# Altium schematic sheet programming.SchDoc
size A
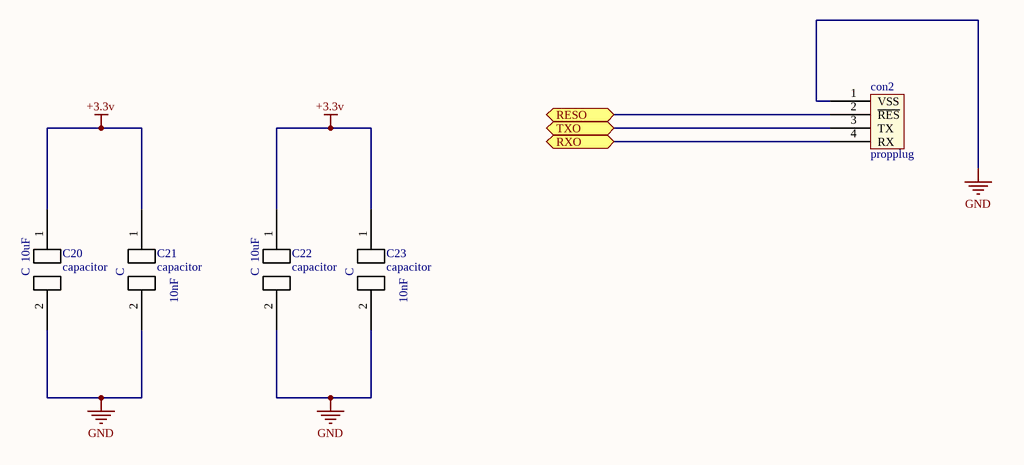
[diagram p0: programming.SchDoc]

## Parts
C20  capacitor  [0603]
C21  capacitor  [0603]
C22  capacitor  [0603]
C23  capacitor  [0603]
con2  propplug

## Ports
RESO, RXO, TXO

## Nets
+3.3v: C20.1 C21.1 C22.1 C23.1
GND: C20.2 C21.2 C22.2 C23.2 con2.1(VSS)
RESO: con2.2(~{RES}) ; port RESO
RXO: con2.4(RX) ; port RXO
TXO: con2.3(TX) ; port TXO

## Notes on the sheet
- (in symbol capacitor) 10uF; C; 10nF